# Altium schematic sheet Electrode Monitor Channel.SchDoc
size A4
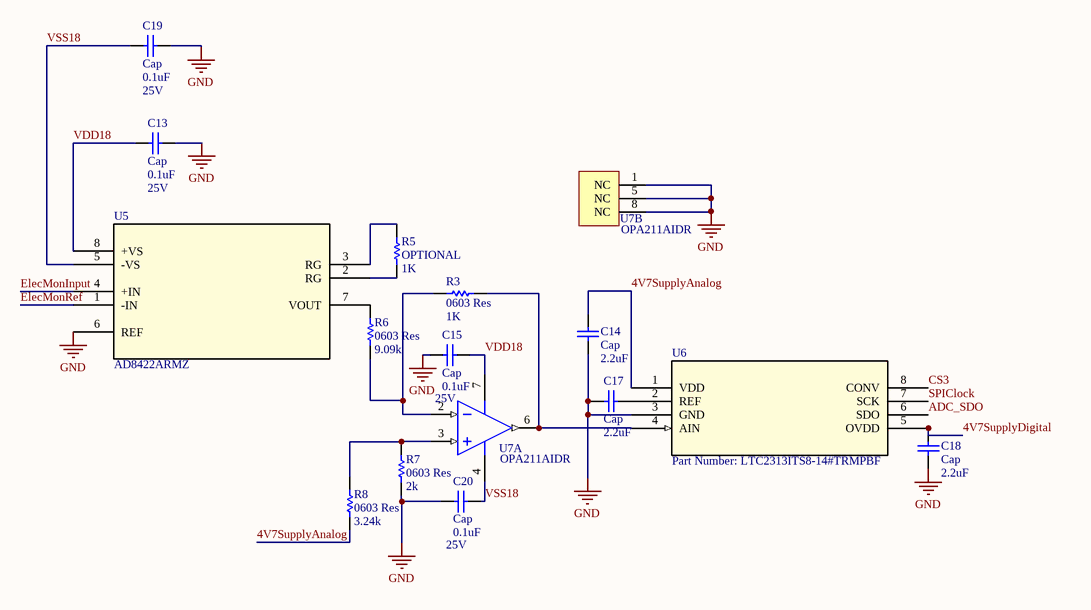
[diagram p0: Electrode Monitor Channel.SchDoc]

## Parts
C13  Cap  value 0.1uF  Rated Voltage: 25V  [1608[0603]]
C14  Cap  value 2.2uF  [1608[0603]]
C15  Cap  value 0.1uF  Rated Voltage: 25V  [1608[0603]]
C17  Cap  value 2.2uF  [1608[0603]]
C18  Cap  value 2.2uF  [1608[0603]]
C19  Cap  value 0.1uF  Rated Voltage: 25V  [1608[0603]]
C20  Cap  value 0.1uF  Rated Voltage: 25V  [1608[0603]]
R3  0603 Res  value 1K  [J1-0603]
R5  OPTIONAL  value 1K  [J1-0603]
R6  0603 Res  value 9.09k  [J1-0603]
R7  0603 Res  value 2k  [J1-0603]
R8  0603 Res  value 3.24k  [J1-0603]
U5  AD8422ARMZ  [MSOP-8]
U6  Part Number: LTC2313ITS8-14#TRMPBF  [TSOT-23_TS8]
U7  OPA211AIDR  [TI-D8_L]  (parts A,B of 2)

## Nets
GND: C13.1 C14.1 C15.1 C17.1 C18.1 C19.1 C20.1 R7.2 U5.6(REF) U6.3(GND) U7.1(NC) U7.5(NC) U7.8(NC)
4V7SupplyAnalog: C14.2 R8.2 U6.1(VDD)
4V7SupplyDigital: C18.2 U6.5(OVDD)
ADC_SDO: U6.6(SDO)
CS3: U6.8(CONV)
ElecMonInput: U5.4(+IN)
ElecMonRef: U5.1(-IN)
SPIClock: U6.7(SCK)
VDD18: C13.2 C15.2 U5.8(+VS) U7.7(V+)
VSS18: C19.2 C20.2 U5.5(-VS) U7.4(V-)
NetC17_2: C17.2 U6.2(REF)
NetR3_1: R3.1 U6.4(AIN) U7.6(OUT)
NetR3_2: R3.2 R6.1 U7.2(IN-)
NetR5_1: R5.1 U5.2(RG)
NetR5_2: R5.2 U5.3(RG)
NetR6_2: R6.2 U5.7(VOUT)
NetR7_1: R7.1 R8.1 U7.3(IN+)

## Library data of the parts
C13-C15 C17-C20 = Cap: Capacitor; Published: 8-Jun-2000; LatestRevisionDate: 17-Jul-2002; LatestRevisionNote: Re-released for DXP Platform.; PackageReference: RAD-0.3; Publisher: Altium Limited; PackageDescription: Radial Cap, Thru-Hole; 2 Leads; 0.3 in Pin Spacing
R3 R5-R8 = Res1: Resistor, gain-setting (OPTIONAL), 0603; Published: 8-Jun-2000; LatestRevisionDate: 17-Jul-2002; LatestRevisionNote: Re-released for DXP Platform.; PackageReference: AXIAL-0.3; Publisher: Altium Limited; PackageDescription: Axial Device, Thru-Hole; 2 Leads; 0.3 in Pin Spacing
U5 = AD8422ARMZ: IC OPAMP INSTR 2.2MHZ RRO 8MSOP; Vendor: Analog Devices Inc; Built_By: EMA_UL_Team; Manufacturer_Part_Number: AD8422ARMZ; Copyright: Copyright (C) 2018 Accelerated Designs. All rights reserved; RefDes: RefDes; Type: DEV; Value: Value
U6 = LTC2313ITS8-14#T: 14-bit 2.5MSPS Single-Ended ADC, 3-5V single supply on TSOT-8; Vendor: Linear Technology; Built_By: EMA_UL_Team; Manufacturer_Part_Number: LTC2313ITS8-14#TRMPBF; Copyright: Copyright (C) 2018 Accelerated Designs. All rights reserved; RefDes: RefDes; Type: DEV; Value: Value
U7 = CMP-0272-00537-2: 1.1 nV/rtHz Noise, Low Power, Precision Operational Amplifier, 4.5 to 36 V, -40 to 125 degC, 8-pin SOIC (D8), Green (RoHS & no Sb/Br); Manufacturer: Texas Instruments; Total Supply Voltage(Min)(+5V is 5, +/-5V is 10): 4.5; Number of Channels: 1; Offset Drift(Typ)(uV/C): 0.15; GBW(Typ)(MHz): 45; Slew Rate(Typ)(V/us): 27; Sub Family: High Supply Voltage Amplifier (>=30V), Low Noise Amp (<=10nV/rtHz), Low Offset Voltage Amplifier (<=500uV), Precision Amplifier; Rating: Catalog; IIB(Max)(pA): 175000; Vio (25C)(Max)(mV): 0.125; Packing: LARGE T&R; Total Supply Voltage(Max)(+5V is 5, +/-5V is 10): 36; CMRR(Min)(dB): 114; Eco-Plan: Green (RoHS & no Sb/Br); DatasheetVersion: SBOS377G; Iq per channel(Max)(mA): 4.5; ComponentLink2URL: http://www.ti.com/lit/ds/symlink/opa211.pdf; ComponentLink1Description: Manufacturer URL; ComponentLink3Description: Package Specification; Code_JEDEC: MS-012; ComponentLink3URL: http://www.ti.com/litv/pdf/msoi002j; PartNumber: OPA211AIDR; ComponentLink2Description: Datasheet; PackageReference: D8; PackageVersion: 4040047-3/M, 06/2011; ComponentLink1URL: http://www.ti.com/; Mounting Technology: Surface Mount; PackageDescription: 8-Pin Plastic Small Outline, Body 4.9 x 3.9 mm, Pitch 1.27 mm; PartId: 1